# EAGLE design rocketpanda_v1 (EAGLE 9.0.1)
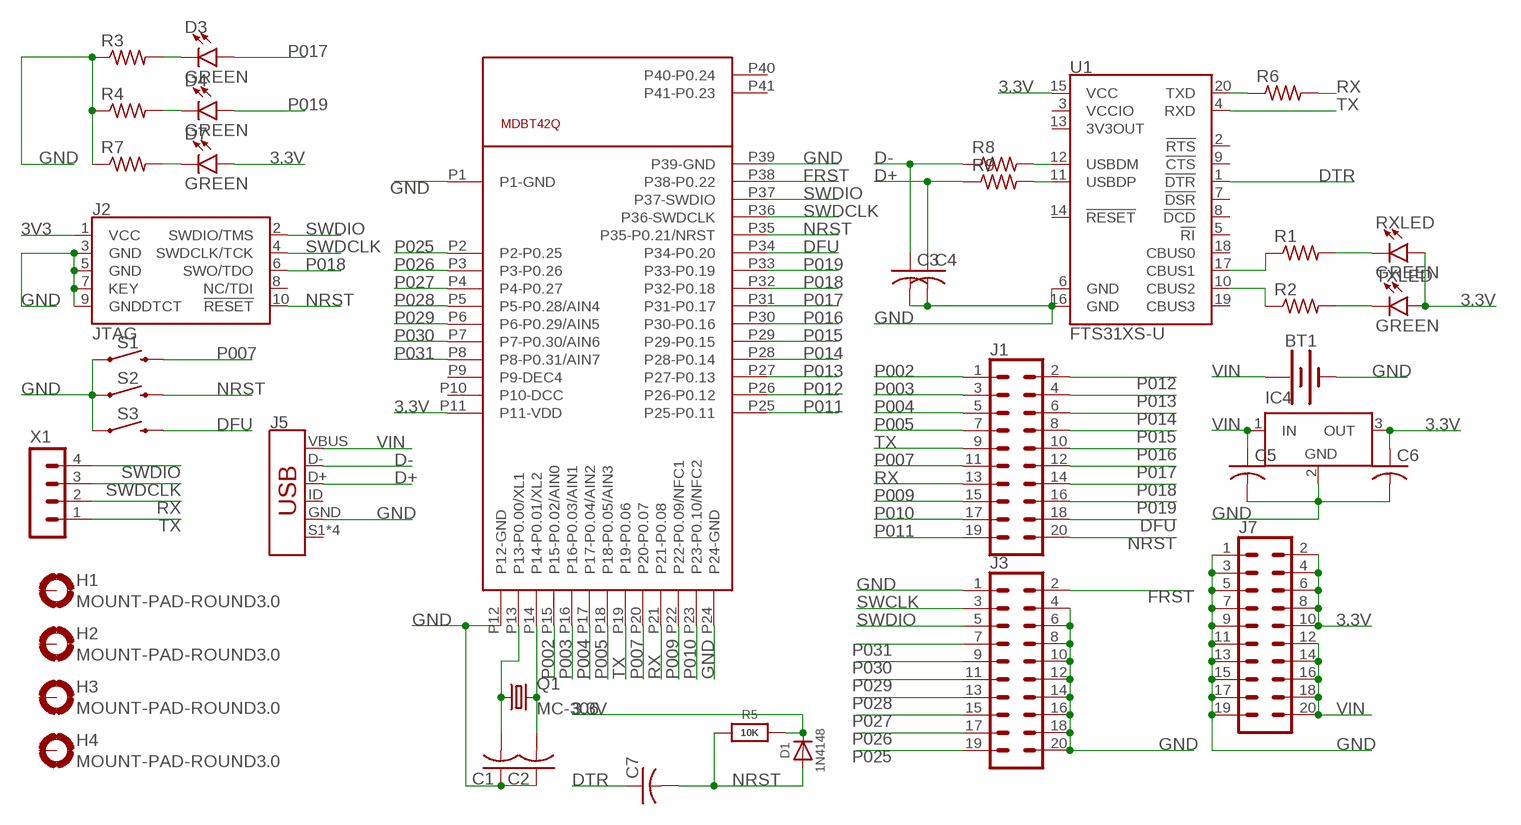
[diagram p0: schematic, sheet 1]

## Parts
BT1  BATTERY-20MM_SMD_4LEGS_OVERPASTE_INNER  [BATTCON_20MM_4LEGS_OVERPASTE_INNER]
C1  C-USC0805  [C0805]
C2  C-USC0805  [C0805]
C3  C-USC0805  [C0805]
C4  C-USC0805  [C0805]
C5  C-USC0805  [C0805]
C6  C-USC0805  [C0805]
C7  C-USC0805  [C0805]
D1  1N4148  DIODESOD-323  [SOD-323]
D3  GREEN  LED-GREENLILYPAD  [LED-1206@1]
D4  GREEN  LED-GREENLILYPAD  [LED-1206@1]
D7  GREEN  LED-GREENLILYPAD  [LED-1206@1]
H1  MOUNT-PAD-ROUND3.0  [3,0-PAD]
H2  MOUNT-PAD-ROUND3.0  [3,0-PAD]
H3  MOUNT-PAD-ROUND3.0  [3,0-PAD]
H4  MOUNT-PAD-ROUND3.0  [3,0-PAD]
IC4  LT1129CST5  [SOT223]
J1  CONN_10X22X10_LOCK  [2X10_LOCK]
J2  JTAG  CORTEX_JTAG_DEBUG_SMD  [2X5-SMD-1.27MM]
J3  CONN_10X22X10_LOCK  [2X10_LOCK]
J5  USB_MINI-B_SMT  [USB-MINIB]
J7  CONN_10X22X10_LOCK  [2X10_LOCK]
Q1  MC-306  [MC-306]
R1  R-US_M0805  [M0805]
R2  R-US_M0805  [M0805]
R3  R-US_M0805  [M0805]
R4  R-US_M0805  [M0805]
R5  10K  RESISTOR0805_NOOUTLINE  [0805-NO]
R6  R-US_M0805  [M0805]
R7  R-US_M0805  [M0805]
R8  R-US_M0805  [M0805]
R9  R-US_M0805  [M0805]
RXLED  GREEN  LED-GREENLILYPAD  [LED-1206@1]
S1  MOMENTARY-SWITCH-SPST-SMD-5.2MM  [TACTILE_SWITCH_SMD_5.2MM]
S2  MOMENTARY-SWITCH-SPST-SMD-5.2MM  [TACTILE_SWITCH_SMD_5.2MM]
S3  MOMENTARY-SWITCH-SPST-SMD-4.6X2.8MM  [TACTILE_SWITCH_SMD_4.6X2.8MM]
TXLED  GREEN  LED-GREENLILYPAD  [LED-1206@1]
U1  FTS31XS-U  FT231XS  [SSOP20_L]
U$1  MDBT42Q  [MDBT40]
X1  B4B-PH-SM4-TB  [B4B-PH-SM4-TB]

## Nets
3.3V: C6.1 D1.C D7.A IC4.3(OUT) J7.2 J7.4 J7.6 J7.8 J7.10 R5.2 RXLED.A TXLED.A U1.15(VCC) U$1.P11(P11-VDD)
3V3: J2.1(VCC)
D+: C4.1 J5.D+ R9.1
D-: C3.1 J5.D- R8.1
DFU: J1.18 S3.3 S3.4 U$1.P34(P34-P0.20)
DTR: C7.1 U1.1(!DTR)
FRST: J3.2 U$1.P38(P38-P0.22)
GND: BT1.2(-) C1.1 C2.1 C3.2 C4.2 C5.2 C6.2 IC4.2(GND) J2.3(GND) J2.5(GND) J2.7(KEY) J2.9(GNDDTCT) J3.1 J3.4 J3.6 J3.8 J3.10 J3.12 J3.14 J3.16 J3.18 J3.20 J5.GND J7.1 J7.3 J7.5 J7.7 J7.9 J7.11 J7.13 J7.15 J7.17 J7.19 R3.1 R4.1 R7.1 S1.1 S2.1 S3.1 S3.2 U1.6(GND) U1.16(GND) U$1.P1(P1-GND) U$1.P12(P12-GND) U$1.P24(P24-GND) U$1.P39(P39-GND)
N$1: D3.C R3.2
N$2: D4.C R4.2
N$3: C2.2 Q1.4 U$1.P14(P14-P0.01/XL2)
N$4: C1.2 Q1.1 U$1.P13(P13-P0.00/XL1)
N$5: D7.C R7.2
N$6: R6.1 U1.20(TXD)
N$40: R1.2 RXLED.C
N$41: R2.2 TXLED.C
N$42: R1.1 U1.17(CBUS1)
N$50: R2.1 U1.10(CBUS2)
N$51: R8.2 U1.12(USBDM)
N$52: R9.2 U1.11(USBDP)
NRST: C7.2 D1.A J1.20 J2.10(!RESET) R5.1 S2.3 U$1.P35(P35-P0.21/NRST)
P002: J1.1 U$1.P15(P15-P0.02/AIN0)
P003: J1.3 U$1.P16(P16-P0.03/AIN1)
P004: J1.5 U$1.P17(P17-P0.04/AIN2)
P005: J1.7 U$1.P18(P18-P0.05/AIN3)
P007: J1.11 S1.3 U$1.P20(P20-P0.07)
P009: J1.15 U$1.P22(P22-P0.09/NFC1)
P010: J1.17 U$1.P23(P23-P0.10/NFC2)
P011: J1.19 U$1.P25(P25-P0.11)
P012: J1.2 U$1.P26(P26-P0.12)
P013: J1.4 U$1.P27(P27-P0.13)
P014: J1.6 U$1.P28(P28-P0.14)
P015: J1.8 U$1.P29(P29-P0.15)
P016: J1.10 U$1.P30(P30-P0.16)
P017: D3.A J1.12 U$1.P31(P31-P0.17)
P018: J1.14 J2.6(SWO/TDO) U$1.P32(P32-P0.18)
P019: D4.A J1.16 U$1.P33(P33-P0.19)
P025: J3.19 U$1.P2(P2-P0.25)
P026: J3.17 U$1.P3(P3-P0.26)
P027: J3.15 U$1.P4(P4-P0.27)
P028: J3.13 U$1.P5(P5-P0.28/AIN4)
P029: J3.11 U$1.P6(P6-P0.29/AIN5)
P030: J3.9 U$1.P7(P7-P0.30/AIN6)
P031: J3.7 U$1.P8(P8-P0.31/AIN7)
RX: J1.13 R6.2 U$1.P21(P21-P0.08) X1.2
SWCLK: J3.3
SWDCLK: J2.4(SWDCLK/TCK) U$1.P36(P36-SWDCLK) X1.3
SWDIO: J2.2(SWDIO/TMS) J3.5 U$1.P37(P37-SWDIO) X1.4
TX: J1.9 U1.4(RXD) U$1.P19(P19-P0.06) X1.1
VIN: BT1.1(+) C5.1 IC4.1(IN) J5.VBUS J7.12 J7.14 J7.16 J7.18 J7.20
Unconnected: H1.B3,0(MOUNT) H2.B3,0(MOUNT) H3.B3,0(MOUNT) H4.B3,0(MOUNT) J2.8(NC/TDI) J5.ID J5.S1(SHIELD) J5.S2(SHIELD) J5.S3(SHIELD) J5.S4(SHIELD) U1.2(!RTS) U1.3(VCCIO) U1.5(!RI) U1.7(!DSR) U1.8(!DCD) U1.9(!CTS) U1.13(3V3OUT) U1.14(!RESET) U1.18(CBUS0) U1.19(CBUS3) U$1.P9(P9-DEC4) U$1.P10(P10-DCC) U$1.P40(P40-P0.24) U$1.P41(P41-P0.23)

## Power pins joined to a net without a drawn wire
GND: IC4.4(GND)

## Library data of the parts
BT1 = SparkFun-Batteries:BATTERY: Battery - Single Cell A variety of battery chemistries, sizes, and footprints. Device List: 20MM_PTH - Coin Cell Battery Holder - 20mm (PTH) <https://www.sparkfun.com/products/783> 20MM_PTH_KIT- Coin Cell battery Holder - 20 mm (PTH) <http://www.sparkfun.com/products/783>kit version with special mask 6.8MM_PTH - Coin Cell Battery Holder - 6.8MM(SMD) <https://www.digikey.com/product-detail/en/seiko-instruments/MS621FE-FL11E/728-1057-ND/1889208?WT.srch=1&gclid=CNOQ5a6LzdQCFZS2wAodXCkE0g> 12MM_SMD - Coin Cell Battery Holder - 12mm (SMD) <https://www.sparkfun.com/products/10592> 12MM_PTH - Coin Cell Battery Holder - 12mm (PTH) <https://www.sparkfun.com/products/7948> 20MM_SMD - 20mm Coin Cell Battery Holder (SMD) (2 legs) Used on the Big Time Watch Kit <https://www.sparkfun.com/products/11734> 20MM_SMD_4LEGS - Coin Cell Battery Holder - 20mm (SMD) <https://www.sparkfun.com/products/11892> 20MM_SMD_4LEGS_OVERPASTE - Coin Cell Battery Holder - 20mm (SMD) <https://www.sparkfun.com/products/11892> (Over-paste on the legs) 24.5MM_PTH - Coin Cell Battery Holder - 24.5mm (PTH) <https://www.sparkfun.com/products/8863> 9V - 9V Battery Holder - PC Mount Used on the SparkFun SparkPunk Sound Kit <https://www.sparkfun.com/products/11177> and SparkFun SparkPunk Sequencer Kit <https://www.sparkfun.com/products/12707> 18650 - Battery Holder - 18650 (PTH) <https://www.sparkfun.com/products/13113> AA - Battery Holder - 1xAA (PTH) <https://www.sparkfun.com/products/7949> AAA - Battery Holder - 1xAAA (PTH) <https://www.sparkfun.com/products/12718> AA_KIT - Battery Holder - 1xAA (PTH) <https://www.sparkfun.com/products/7949> Special kit package - pads only have exposed copper on one side of the board. AAA_KIT - Battery Holder - 1xAAA (PTH) <https://www.sparkfun.com/products/12718> Special kit package - pads only have exposed copper on one side of the board.
C1-C7 = adafruit:C-US: CAPACITOR, American symbol
D1 = microbuilder:DIODE: Diode SMA Model Volts Amps Type Vf Ir Digikey # Notes SSA34-E3 40V 3A Schottky 480mV @ 3A 200uA @ 40V SSA34-E3/61TGITR-ND CDBA120-G 20V 1A Schottky 500mV @ 1A 500uA @ 20V 641-1014-6-ND REEL MBRA210 10V 2A Schottky 350mV @ 2A 700uA @ 10V MBRA210LT3 SOD-123 Model Volts Amps Type Vf Ir Order # Notes BAT54T1G 30V 200mA Schottky 800mV @ 200mA 2uA @ 25V BAT54T1GOSTR-ND B0530W 30V 500mA Schottky 430mV @ 500mA 130uA @ 30V B0530W-FDICT-ND REEL MBR120 20V 1A Schottky 340mV @ 1A MBR120VLSFT1GOSCT-ND SOD-323 Model Volts Amps Type Vf Ir Order # Notes PMEG2005EJ 20V 500mA Schottky 355mV @ 500mA 568-4110-1-ND ZLLS410 10V 570mA Schottky 380mV @ 570mA ZLLS410CT-ND 1N4148WS 75V 150mA Silicon/Simple 1V 1N4148WSFSCT-ND REEL SOD-523 Model Volts Amps Type Vf Ir Order # Notes BAT54XV2 30V 200mA Schottky 0.8V @ 100mA BAT54XV2CT-ND TB751S 30V 30mA Schottky RB751S-40TE61CT-ND SOT23-R/W (R = Solder Paste/Reflow Ovens, W = Hand-Soldering) Model Volts Amps Type Vf Ir Order # Notes BAT54FILM 40V 300mA Schottky 497-7162-1-ND POWERDI-5 Model Volts Amps Type Vf Ir Order # Notes PDS560 60V 5A Schottky 670mV @ 5A 150uA @ 60V PDS560DICT-ND
D3 D4 D7 RXLED TXLED = SparkFun-LED:LED-GREEN: Green SMD LED Used in manufacturing of various products at SparkFun Packages: 0603 - SMD 0603 package [Product Link] <http://www.futureelectronics.com/en/technologies/semiconductors/optoelectronics/leds/Pages/9894312-LTST-C190GKT.aspx?CrossPart=HSMG-C190&IM=0> LilyPad 1206 - SMD1206 LilyPad package [Product Link] <http://www.futureelectronics.com/en/Technologies/Product.aspx?ProductID=IN150NGHARVATEKCORPORATION2049943&IM=0> 1206 - SMD1206 package [Product Link] <http://www.futureelectronics.com/en/technologies/semiconductors/optoelectronics/leds/Pages/8315665-LTST-C150KGKT.aspx?IM=0> 1206 Bottom Mount -SMD 1206 Bottom Mount [Product Link] <http://www.digikey.com/product-detail/en/lite-on-inc/LTST-C230KGKT/160-1456-1-ND/386854> SparkFun Products: Pro Mini 328 -5V <https://www.sparkfun.com/products/821> RedBoard <https://www.sparkfun.com/products/12757> MP3 Trigger <https://www.sparkfun.com/products/13720> Makey Makey <https://www.sparkfun.com/products/11076>; PROD_ID: DIO-09910
H1-H4 = holes:MOUNT-PAD-ROUND: MOUNTING PAD, round
IC4 = linear-technology:LT1129CST5: VOLTAGE REGULATOR with shutdown; MPN: LT1129CST-5#PBF; OC_FARNELL: 1663375; OC_NEWARK: 57M2069
J1 J3 J7 = SparkFun-Connectors:CONN_10X2: Multi connection point. Often used as Generic Header-pin footprint for 0.1 inch spaced/style header connections On any of the 0.1 inch spaced packages, you can populate with these: Break Away Headers - Straight <https://www.sparkfun.com/products/116> (PRT-00116) Break Away Male Headers - Right Angle <https://www.sparkfun.com/products/553> (PRT-00553) Female Headers <https://www.sparkfun.com/products/115> (PRT-00115) Break Away Headers - Machine Pin <https://www.sparkfun.com/products/117> (PRT-00117) Break Away Female Headers - Swiss Machine Pin <https://www.sparkfun.com/products/743> (PRT-00743) Special note about the "SPECIAL" package: This was SPECIALLY designed to be used with our Graphic LCD Backpack. Be sure you want to use this! It is not only staggered on each line of header holes, but IT IS ALSO offset of the center point of the top and bottom lines by 5 mil. This causes the headers to lock into place on the "standard" footprint on the LCD screen. The extra squares on the tdocu layer are there simply to reference other pins (if you were to actually populate a longer header than ten long - this is what we do with the backpacks).
J2 = SparkFun-Connectors:CORTEX_JTAG_DEBUG: Cortex Debug Connector - 10 pin Supports JTAG debug, Serial Wire debug, and Serial Wire Viewer. PTH and SMD connector options available. General Connector Information <http://infocenter.arm.com/help/topic/com.arm.doc.faqs/attached/13634/cortex_debug_connectors.pdf> Products: PTH Connector <http://www.digikey.com/product-detail/en/cnc-tech/3220-10-0100-00/1175-1627-ND/3883661> -via Digi-Key SparkFun PSoc <https://www.sparkfun.com/products/13229> SparkFun T <https://www.sparkfun.com/products/13810>; PROD_ID: CONN-14503
J5 = SparkFun-Connectors:USB_MINI-B: USB type Mini-B Connector Breaks out 5th pin, and includes shield pins if needed. SparkFun Products: SparkFun FTDI Basic Breakout <https://www.sparkfun.com/products/9716> SparkFun XBee Explorer USB <https://www.sparkfun.com/products/11812> SparkFun Redboard <https://www.sparkfun.com/products/12757>; PROD_ID: CONN-08193; SF_ID: PRT-00587
Q1 = crystal:MC-306: kHz RANGE CRYSTAL UNIT SMD Source: MC-306_405_406_E07X.PDF Homepage <http://www.epsontoyocom.co.jp>; MPN: MC-306 60.0KHZ 100PPM ,12.5PF; OC_FARNELL: 1278040; OC_NEWARK: 31M5576
R1-R4 R6-R9 = adafruit:R-US_: RESISTOR, American symbol
R5 = microbuilder:RESISTOR: Resistors For new designs, use the packages preceded by an '_' character since they are more reliable: The following footprints should be used on most boards: _0402 - Standard footprint for regular board layouts _0603 - Standard footprint for regular board layouts _0805 - Standard footprint for regular board layouts _1206 - Standard footprint for regular board layouts For extremely tight-pitch boards where space is at a premium, the following 'micro-pitch' footprints can be used (smaller pads, no silkscreen outline, etc.): _0402MP - Micro-pitch footprint for very dense/compact boards _0603MP - Micro-pitch footprint for very dense/compact boards _0805MP - Micro-pitch footprint for very dense/compact boards _1206MP - Micro-pitch footprint for very dense/compact boards
S1 S2 = SparkFun-Switches:MOMENTARY-SWITCH-SPST: Momentary Switch (Pushbutton) - SPST Normally-open (NO) SPST momentary switches (buttons, pushbuttons). Variants PTH-12MM - 12mm square, through-hole Momentary Pushbutton Switch - 12mm Square <https://www.sparkfun.com/products/9190> (COM-09190) PTH-6.0MM, PTH-6.0MM-KIT - 6.0mm square, through-hole Mini Pushbutton Switch <https://www.sparkfun.com/products/97> (COM-00097) KIT package intended for soldering kit's - only one side of pads' copper is exposed. PTH-RIGHT-ANGLE-KIT - Right-angle, through-hole Right Angle Tactile Button <https://www.sparkfun.com/products/10791> - Used on SparkFun BigTime Watch Kit <https://www.sparkfun.com/products/11734> SMD-12MM - 12mm square, surface-mount Tactile Button - SMD (12mm) <https://www.sparkfun.com/products/12993> (COM-12993) Used on SparkFun PicoBoard <https://www.sparkfun.com/products/11888> SMD-4.5MM - 4.5mm Square Trackball Switch Used on SparkFun Blackberry Trackballer Breakout <https://www.sparkfun.com/products/13169> SMD-4.6MMX2.8MM - 4.60mm x 2.80mm, surface mount Used on SparkFun SAMD21 Mini Breakout <https://www.sparkfun.com/products/13664> SMD-5.2MM, SMD-5.2-REDUNDANT - 5.2mm square, surface-mount Mini Pushbutton Switch - SMD <https://www.sparkfun.com/products/8720> (COM-08720) Used on Arduino Pro Mini <https://www.sparkfun.com/products/11114> REDUNDANT package connects both switch circuits together SMD-6.0X3.5MM - 6.0 x 3.5mm, surface mount Momentary Reset Switch SMD <https://www.sparkfun.com/products/8229> (COM-08229) SMD-6.2MM-TALL - 6.2mm square, surface mount Tactile Button - SMD (6mm) <https://www.sparkfun.com/products/12992> Used on SparkFun Digital Sandbox <https://www.sparkfun.com/products/12651> SMD-RIGHT-ANGLE - Right-angle, surface mount Used on SparkFun Block for Intel® Edison - Arduino <https://www.sparkfun.com/products/13036>; PROD_ID: SWCH-08247; SF_SKU: COM-08720
S3 = SparkFun-Switches:MOMENTARY-SWITCH-SPST: Momentary Switch (Pushbutton) - SPST Normally-open (NO) SPST momentary switches (buttons, pushbuttons). Variants PTH-12MM - 12mm square, through-hole Momentary Pushbutton Switch - 12mm Square <https://www.sparkfun.com/products/9190> (COM-09190) PTH-6.0MM, PTH-6.0MM-KIT - 6.0mm square, through-hole Mini Pushbutton Switch <https://www.sparkfun.com/products/97> (COM-00097) KIT package intended for soldering kit's - only one side of pads' copper is exposed. PTH-RIGHT-ANGLE-KIT - Right-angle, through-hole Right Angle Tactile Button <https://www.sparkfun.com/products/10791> - Used on SparkFun BigTime Watch Kit <https://www.sparkfun.com/products/11734> SMD-12MM - 12mm square, surface-mount Tactile Button - SMD (12mm) <https://www.sparkfun.com/products/12993> (COM-12993) Used on SparkFun PicoBoard <https://www.sparkfun.com/products/11888> SMD-4.5MM - 4.5mm Square Trackball Switch Used on SparkFun Blackberry Trackballer Breakout <https://www.sparkfun.com/products/13169> SMD-4.6MMX2.8MM - 4.60mm x 2.80mm, surface mount Used on SparkFun SAMD21 Mini Breakout <https://www.sparkfun.com/products/13664> SMD-5.2MM, SMD-5.2-REDUNDANT - 5.2mm square, surface-mount Mini Pushbutton Switch - SMD <https://www.sparkfun.com/products/8720> (COM-08720) Used on Arduino Pro Mini <https://www.sparkfun.com/products/11114> REDUNDANT package connects both switch circuits together SMD-6.0X3.5MM - 6.0 x 3.5mm, surface mount Momentary Reset Switch SMD <https://www.sparkfun.com/products/8229> (COM-08229) SMD-6.2MM-TALL - 6.2mm square, surface mount Tactile Button - SMD (6mm) <https://www.sparkfun.com/products/12992> Used on SparkFun Digital Sandbox <https://www.sparkfun.com/products/12651> SMD-RIGHT-ANGLE - Right-angle, surface mount Used on SparkFun Block for Intel® Edison - Arduino <https://www.sparkfun.com/products/13036>; PROD_ID: SWCH-13065
U1 = SparkFun-DigitalIC:FT231X: FTDI FT231X Full Speed USB to Full-handshake UART This USB2.0 Full Speed IC offers a compact bridge to full handshake UART interfaces. The device is a UART, capable of operating up to 3MBaud, with low power consumption (8mA). The FT231X includes the complete FT-X series feature set and enables USB to be added into a system design quickly and easily over a UART interface.; PROD_ID: IC-11524
U$1 = mdbt42:MDBT42Q
X1 = con-JST PH:B4B-PH: JST PH series header 2.00mm pitch disconnectable crimp style connectors, vertical (side entry type), 4 pins

## Board
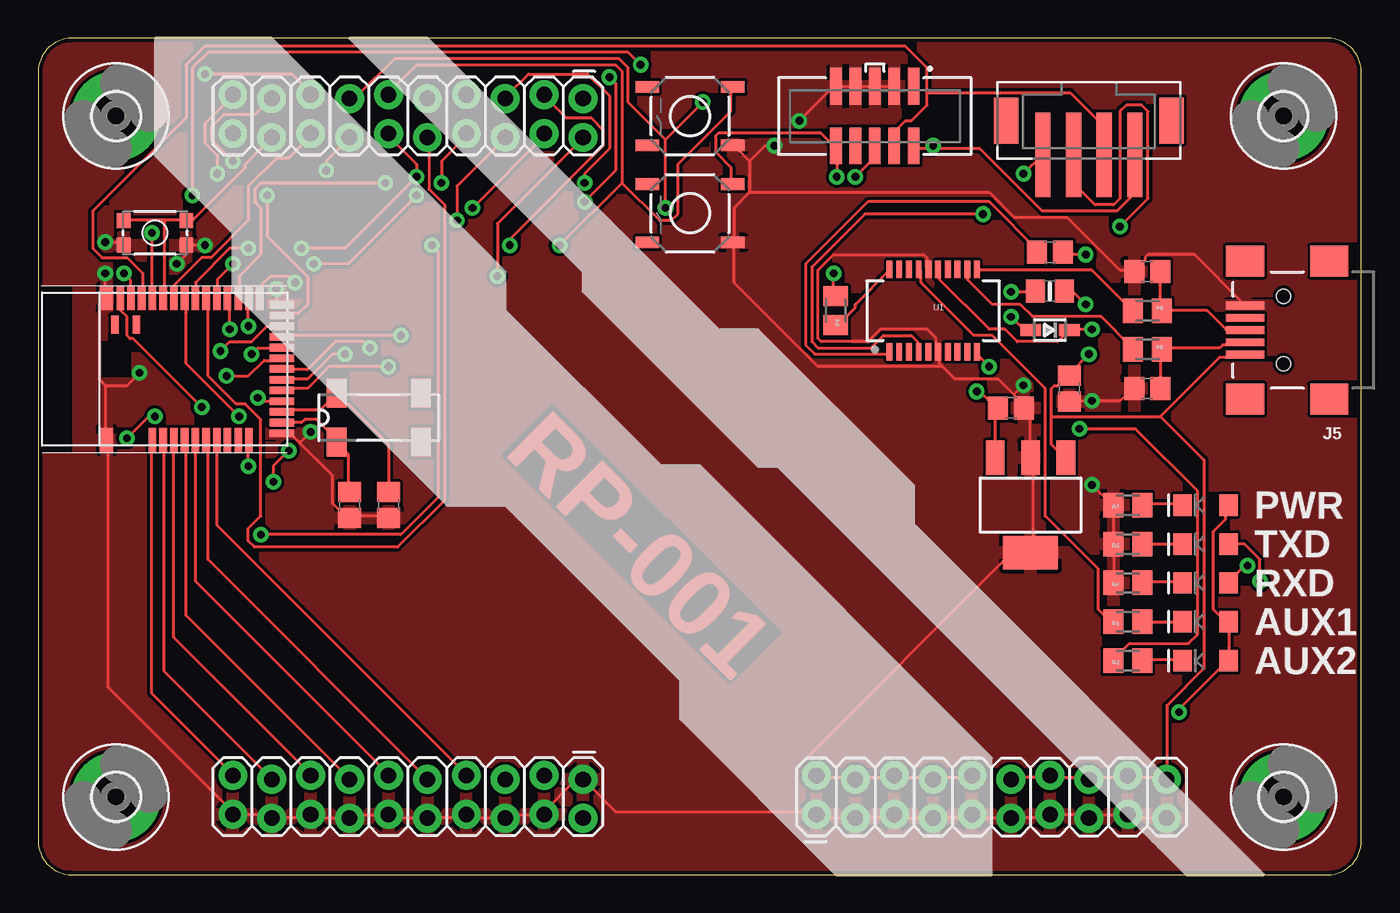
[diagram p1: board, top side]
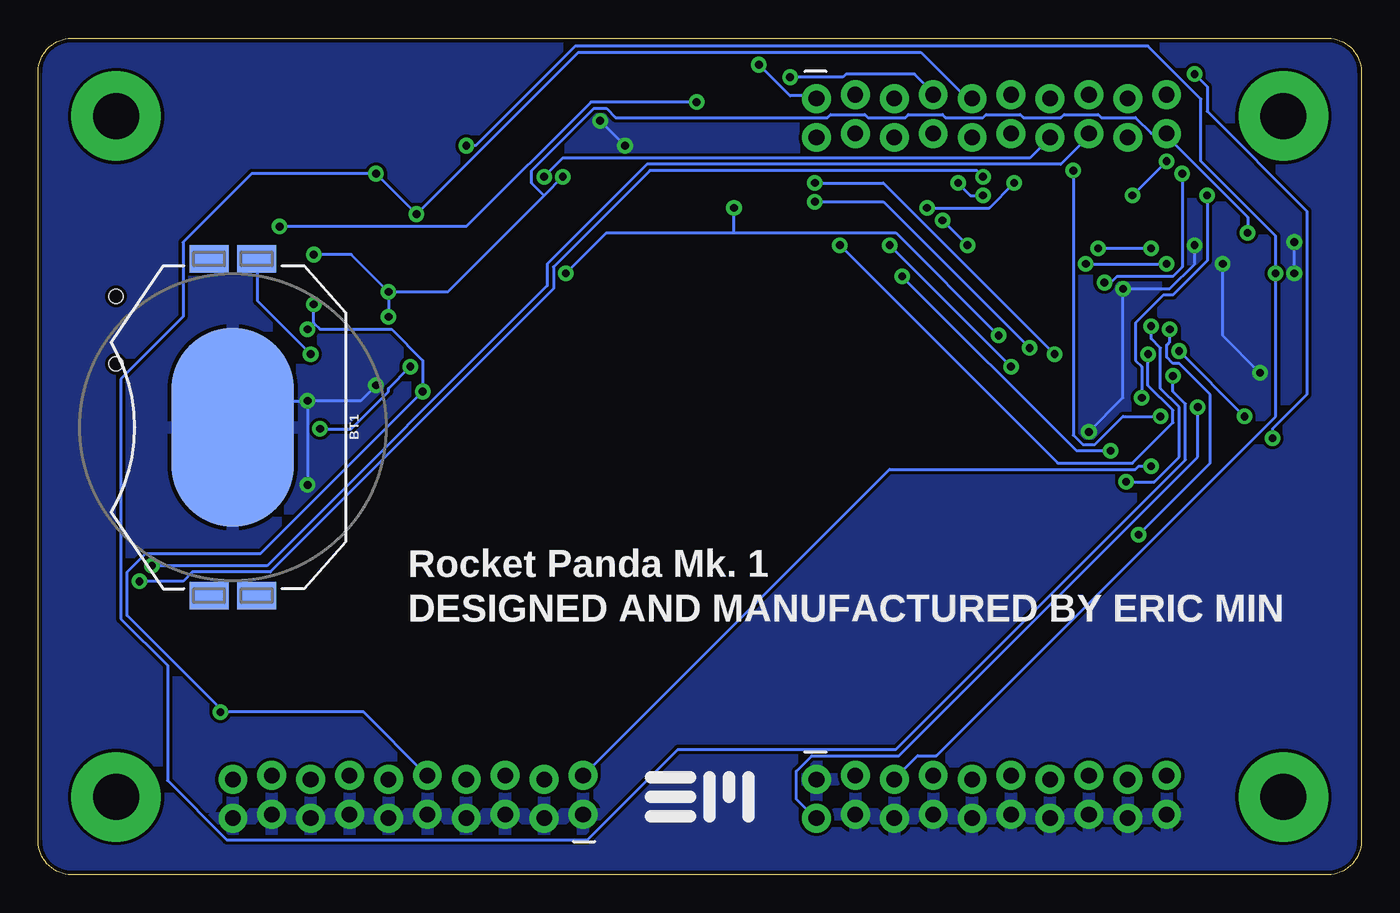
[diagram p2: board, bottom side, seen from below]

Size 86.36 x 54.61 mm. Coordinates in mm from the lower left corner, seen from the top.
Outline: 0,2.17 arc90 2.17,0 84.19,0 arc90 86.36,2.17 86.36,52.44 arc90 84.19,54.61 2.17,54.61 arc90 0,52.44 0,2.17
Copper layers (1*16): Top 0.035mm / dielectric 1.5mm / Bottom 0.035mm
Design rules "SparkFun": minimum track width 8mil, minimum drill 20mil, track to track 8mil, track to pad 8mil, pad to pad 8mil, via to via 8mil, smd to smd 8mil, copper to edge 10mil, drill to drill 8mil, minimum pad ring 12mil, minimum via ring 10mil, stop-mask expansion 4mil, vias tented up to drill 25mil, thermal gap 10mil
tKeepout: area 0,8.9 to 3.2,45.7
bKeepout: area 0,8.9 to 3.2,45.7

### Footprints (pad centres in the part's own frame; a part is rotated, then mirrored left to right if it is on the bottom)
BATTCON_20MM_4LEGS_OVERPASTE_INNER = smd 1.778 x 2.54: 1 -11,1.55; 3 11,1.55; P$1 -11,-1.55; P$2 11,-1.55 | smd 13 x 8: 2 0,0
C0805 = smd 1.3 x 1.5: 1 -0.85,0; 2 0.85,0
SOD-323 = smd 1.35 x 0.8: A 1.27,0; C -1.27,0
LED-1206@1 = smd 1.2 x 1.4: A -1.5,0; C 1.5,0
3,0-PAD = drill 3 pad 5.842: B3,0 0,0
SOT223 = smd 1.219 x 2.235: 1 -2.311,-3.099; 2 0,-3.099; 3 2.311,-3.099 | smd 3.6 x 2.2: 4 0,3.099
2X10_LOCK = drill 1.016 pad 1.88: 1 0,0.127; 2 0,2.667; 3 2.54,-0.127; 4 2.54,2.413; 5 5.08,0.127; 6 5.08,2.667; 7 7.62,-0.127; 8 7.62,2.413; 9 10.16,0.127; 10 10.16,2.667; 11 12.7,-0.127; 12 12.7,2.413; 13 15.24,0.127; 14 15.24,2.667; 15 17.78,-0.127; 16 17.78,2.413; 17 20.32,0.127; 18 20.32,2.667; 19 22.86,-0.127; 20 22.86,2.413
2X5-SMD-1.27MM = smd 0.76 x 2.4: 1 2.54,1.95; 2 2.54,-1.95; 3 1.27,1.95; 4 1.27,-1.95; 5 0,1.95; 6 0,-1.95; 7 -1.27,1.95; 8 -1.27,-1.95; 9 -2.54,1.95; 10 -2.54,-1.95
USB-MINIB = smd 2.5 x 0.5: D+ 2.5,0; D- 2.5,0.8; GND 2.5,-1.6; ID 2.5,-0.8; VBUS 2.5,1.6 | smd 2.5 x 2: S1 -3,4.5; S2 2.5,4.5; S3 -3,-4.5; S4 2.5,-4.5 | hole 0.9: 0,2.2; 0,-2.2
MC-306 = smd 1.3 x 1.9: 1 -2.75,-1.6; 2 2.75,-1.6; 3 2.75,1.6; 4 -2.75,1.6
M0805 = smd 1.3 x 1.6: 1 -0.95,0; 2 0.95,0
0805-NO = smd 1.24 x 1.5: 1 -0.95,0; 2 0.95,0
TACTILE_SWITCH_SMD_5.2MM = smd 1.524 x 0.762: 1 -2.794,1.905; 2 2.794,1.905; 3 -2.794,-1.905; 4 2.794,-1.905
TACTILE_SWITCH_SMD_4.6X2.8MM = smd 0.9 x 1: 1 -2.05,-0.8; 2 2.05,-0.8; 3 2.05,0.8; 4 -2.05,0.8
SSOP20_L = smd 0.381 x 1.143: 1 -2.857,-2.68; 2 -2.223,-2.68; 3 -1.587,-2.68; 4 -0.953,-2.68; 5 -0.318,-2.68; 6 0.318,-2.68; 7 0.953,-2.68; 8 1.587,-2.68; 9 2.223,-2.68; 10 2.857,-2.68; 11 2.857,2.68; 12 2.223,2.68; 13 1.587,2.68; 14 0.953,2.68; 15 0.318,2.68; 16 -0.318,2.68; 17 -0.953,2.68; 18 -1.587,2.68; 19 -2.223,2.68; 20 -2.857,2.68
MDBT40 = smd 1.6 x 0.9: P1 -4.65,3.8; P39 4.65,3.8 | smd 1.6 x 0.5: P2 -4.65,0.8; P3 -4.65,0.1; P4 -4.65,-0.6; P5 -4.65,-1.3; P6 -4.65,-2; P7 -4.65,-2.7; P8 -4.65,-3.4; P9 -4.65,-4.1; P10 -4.65,-4.8; P11 -4.65,-5.5; P25 4.65,-6.2; P26 4.65,-5.5; P27 4.65,-4.8; P28 4.65,-4.1; P29 4.65,-3.4; P30 4.65,-2.7; P31 4.65,-2; P32 4.65,-1.3; P33 4.65,-0.6; P34 4.65,0.1; P35 4.65,0.8; P36 4.65,1.5; P37 4.65,2.2; P38 4.65,2.9 | smd 0.5 x 1.6: P12 -4.2,-7.65; P13 -3.5,-7.65; P14 -2.8,-7.65; P15 -2.1,-7.65; P16 -1.4,-7.65; P17 -0.7,-7.65; P18 0,-7.65; P19 0.7,-7.65; P20 1.4,-7.65; P21 2.1,-7.65; P22 2.8,-7.65; P23 3.5,-7.65; P24 4.2,-7.65 | smd 1.2 x 0.5: P40 2.9,3.25; P41 2.9,1.85
B4B-PH-SM4-TB = smd 1 x 5.5: 1 3,0; 2 1,0; 3 -1,0; 4 -3,0 | smd 1.6 x 3: M1 5.4,-2.25; M2 -5.4,-2.25

### Placement (x,y rotation side)
BT1  73.66,29.21 270 bottom
C1  20.32,24.13 90 top
C2  22.86,24.13 90 top
C3  72.39,31.75 180 top
C4  72.39,39.37 180 top
C5  67.31,31.75 270 top
C6  63.5,30.48 0 top
C7  66.04,40.64 0 top
D1  66.04,35.56 180 top
D3  76.2,21.59 180 top
D4  76.2,19.05 180 top
D7  76.2,24.13 180 top
H1  5.08,49.53 0 top
H2  81.28,49.53 0 top
H3  5.08,5.08 0 top
H4  81.28,5.08 0 top
IC4  64.77,24.13 180 top
J1  35.56,50.8 180 top
J2  54.61,49.53 0 top
J3  35.56,6.35 180 top
J5  81.28,35.56 180 top
J7  50.8,3.81 0 top
Q1  22.22,29.84 0 top
R1  71.12,16.51 0 top
R2  71.12,13.97 0 top
R3  71.12,21.59 0 top
R4  71.12,19.05 0 top
R5  66.04,38.1 0 top
R6  52.07,36.83 90 top
R7  71.12,24.13 0 top
R8  72.39,34.29 180 top
R9  72.39,36.83 180 top
RXLED  76.2,16.51 180 top
S1  42.55,49.53 180 top
S2  42.55,43.18 180 top
S3  7.62,41.91 0 top
TXLED  76.2,13.97 180 top
U1  58.42,36.83 0 top
U$1  8.25,33.02 90 top
X1  68.58,46.99 180 top

### Tracks (layer width: path | path; a pad name or v marks a point on that pad's centre or on a via)
3.3V  (via drill 0.51)
  Top 0.203: IC4.3 62.48,27.28 62.48,30.33 C6.1 62.48,30.53 61.47,31.55 v61.27,31.55 | U1.15 58.83,39.47 58.83,38.86 62.08,35.61 63.09,35.61 63.91,34.8 66.55,34.8 D1.C 67.36,35.61 v68.78,35.61 | v68.38,37.24 67.56,38.05 67.16,38.05 R5.2 | D7.A 77.52,24.03 77.52,23.22 76.71,22.4 76.71,17.32 77.52,16.51 RXLED.A 77.72,16.51 77.72,14.07 TXLED.A 77.52,13.87 74.47,10.82 v74.47,10.62 | 58.42,6.35 55.98,6.35 J7.6 55.78,6.35 53.34,6.35 | 58.42,6.35 60.86,6.35 J7.10 | 58.42,6.35 J7.8 | v13.72,26.67 13.72,28.3 U$1.P11 | 53.34,6.35 50.9,6.35 J7.2 | 53.34,6.35 J7.4
  Bottom 0.203: 68.38,36.02 v68.38,37.24 | v68.78,35.61 68.38,36.02 | 68.38,36.02 67.97,35.61 63.3,35.61 61.27,33.58 v61.27,31.55 71.83,20.98 79.35,20.98 80.57,19.76 80.57,16.92 74.27,10.62 | 74.27,10.62 65.13,10.62 61.06,6.55 J7.10 | 74.27,10.62 v74.47,10.62 | v13.72,26.67 14.53,26.67 14.73,26.47 30.79,26.47 50.7,6.55 J7.2
D+
  Top 0.203: C4.1 73.25,39.27 73.25,36.83 R9.1 76.3,36.83 77.52,35.61 78.74,35.61 J5.D+
D-
  Top 0.203: C3.1 73.25,31.75 73.25,34.19 R8.1 73.46,34.39 77.11,34.39 77.32,34.6 78.74,34.6 J5.D-
DFU
  Top 0.203: 8.23,42.72 9.65,42.72 S3.3 9.86,42.52 13.51,46.18 13.51,46.38 15.14,48.01 J1.18 | 8.23,42.72 5.59,42.72 S3.4 | 8.23,42.72 8.23,37.85 U$1.P34
DTR
  Top 0.203: U1.1 55.57,33.99 50.7,33.99 50.09,34.6 50.09,39.88 54.15,43.94 62.08,43.94 65.33,40.69 C7.1
FRST  (via drill 0.51)
  Top 0.203: v10.67,30.53 6.2,35 5.99,35 5.79,35.2 5.79,36.42 5.38,36.83 5.38,37.64 U$1.P38
  Bottom 0.203: v10.67,30.53 10.67,27.28 30.18,7.77 35.87,7.77 36.88,6.76 36.88,4.93 35.66,3.71 J3.2
GND  (via drill 0.51)
  Top 0.203: 70.21,21.59 70.21,19.15 R4.1 | 70.21,21.59 70.21,24.03 R7.1 70,24.23 v68.78,25.45 | 70.21,21.59 R3.1 | C5.2 67.36,30.94 v68.78,30.94 70.61,30.94 71.43,31.75 C3.2 | J5.GND 78.74,37.24 75.49,40.49 72.44,40.49 72.24,40.28 72.24,40.08 71.63,39.47 C4.2 71.43,39.47 70.61,39.47 67.16,42.93 63.7,42.93 62.08,44.55 46.43,44.55 | 53.34,51.46 52.12,51.46 J2.9 51.92,51.46 v49.68,49.23 | J2.3 55.78,51.46 54.76,51.46 J2.5 54.56,51.46 53.34,51.46 | 53.34,51.46 J2.7 | 46.43,44.55 45.41,43.54 45.41,41.3 S2.1 45.41,41.1 45.41,38.66 50.9,33.17 59.03,33.17 | 46.43,46.58 46.43,44.55 | 46.43,46.58 45.41,47.6 S1.1 | 59.03,33.17 59.84,32.36 62.69,32.36 63.7,31.34 | 59.03,33.17 58.83,33.38 58.83,33.99 U1.6 58.62,34.19 58.62,35 58.01,35.61 54.97,35.61 54.15,34.8 51.1,34.8 50.9,35 50.9,39.47 51.92,40.49 57.81,40.49 58.01,40.28 58.01,39.68 U1.16 | 63.7,31.34 64.52,30.53 C6.2 64.52,30.33 64.72,30.12 64.72,27.28 IC4.2 64.92,27.08 64.92,21.18 IC4.4 64.72,20.98 63.5,20.98 49.48,6.96 49.48,4.12 | v48.06,47.6 47.45,47.6 46.43,46.58 | 63.7,31.34 v64.31,31.95 | v10.87,41.1 9.86,41.1 S3.2 9.65,41.1 9.65,40.49 v9.04,39.88 | v15.55,38.25 15.55,37.44 15.75,37.24 U$1.P24 | C2.1 22.86,23.42 20.42,23.42 C1.1 20.22,23.22 19.2,24.23 19.2,26.06 16.97,28.3 | 16.97,28.3 16.56,28.7 15.95,28.7 U$1.P12 | v17.78,28.91 17.17,28.3 16.97,28.3 | 53.34,3.71 51.1,3.71 50.9,3.91 J7.1 50.7,4.12 49.48,4.12 | 58.42,3.71 56.19,3.71 55.98,3.91 J7.5 55.78,3.91 55.57,3.71 53.34,3.71 | 53.34,3.71 J7.3 | 63.5,3.71 61.27,3.71 61.06,3.91 J7.9 60.86,3.91 60.66,3.71 58.42,3.71 | 68.38,3.91 66.14,3.91 J7.13 65.94,3.91 65.73,3.71 63.5,3.71
  Top 0.203: 68.38,3.91 68.58,3.71 J7.15 68.38,3.91 | 68.38,3.91 71.02,3.91 J7.17 71.22,3.91 71.43,3.71 73.66,3.71 J7.19 | 63.5,3.71 J7.11 | 58.42,3.71 J7.7 | 27.74,3.71 25.5,3.71 J3.10 25.3,3.71 23.06,3.71 22.86,3.91 | 27.74,3.71 27.94,3.91 J3.8 27.74,3.71 | 27.74,3.71 30.38,3.71 J3.6 30.58,3.71 30.79,3.91 33.02,3.91 J3.4 33.02,4.12 35.05,6.15 35.46,6.15 J3.1 35.66,6.15 37.69,4.12 49.48,4.12 | v4.37,41.3 5.38,41.3 S3.1 | v4.37,39.27 4.37,37.85 U$1.P39 4.37,37.64 3.96,37.24 3.96,32.36 4.37,31.95 | 4.37,31.95 4.37,28.5 U$1.P1 4.57,28.3 4.57,12.24 12.7,4.12 J3.20 12.7,3.91 14.93,3.91 15.14,3.71 J3.18 15.34,3.71 17.58,3.71 | 17.58,3.71 17.78,3.91 J3.16 17.58,3.71 | 17.58,3.71 20.22,3.71 J3.14 20.42,3.71 20.62,3.91 22.86,3.91 | 22.86,3.91 J3.12 | v6.6,32.77 5.79,31.95 4.37,31.95
  Bottom 0.203: v68.78,30.94 72.03,30.94 73.66,29.31 BT1.2 | v68.78,30.94 v68.78,25.45 | v48.06,47.6 v49.68,49.23 | v68.78,30.94 65.33,30.94 v64.31,31.95 | v10.87,41.1 10.87,39.88 12.5,38.25 v15.55,38.25 15.55,31.14 v17.78,28.91 | v4.37,39.27 v4.37,41.3 | v9.04,39.88 9.04,35.2 v6.6,32.77
  pour Top: -5.08,62.23 92.71,62.23 92.71,-7.62 -5.08,-7.62
  pour Bottom: -2.54,58.42 88.9,58.42 88.9,-3.81 -2.54,-3.81
N$1
  Top 0.203: R3.2 D3.C
N$2
  Top 0.203: D4.C 74.68,19.15 72.24,19.15 R4.2
N$3
  Top 0.203: C2.2 22.86,28.09 19.61,31.34 Q1.4 19.41,31.34 18.39,30.33 15.95,30.33 U$1.P14
N$4
  Top 0.203: C1.2 20.22,25.04 20.22,27.48 19.61,28.09 Q1.1 19.61,28.3 18.19,29.72 17.37,29.72 17.17,29.52 15.95,29.52 U$1.P13
N$5
  Top 0.203: D7.C 74.68,24.23 72.24,24.23 R7.2
N$6
  Top 0.203: U1.20 55.57,39.47 53.34,37.24 53.34,37.03 52.12,35.81 R6.1
N$40
  Top 0.203: R1.2 RXLED.C
N$41
  Top 0.203: TXLED.C 74.68,14.07 72.24,14.07 R2.2
N$42
  Top 0.203: U1.17 57.61,39.47 57.61,38.66 61.06,35.2 62.28,35.2 65.73,31.75 65.73,23.42 69.19,19.96 69.19,17.32 70,16.51 R1.1
N$50  (via drill 0.51)
  Top 0.203: v62.08,33.17 61.27,33.99 U1.10 | v67.97,29.11 71.63,29.11 75.69,25.04 75.69,15.7 75.08,15.09 71.22,15.09 70.21,14.07 R2.1
  Bottom 0.203: v62.08,33.17 63.5,31.75 63.5,31.55 65.94,29.11 v67.97,29.11
N$51
  Top 0.203: U1.12 60.66,39.47 60.66,38.86 62.28,37.24 64.11,37.24 64.92,36.42 69.39,36.42 71.43,34.39 R8.2
N$52
  Top 0.203: U1.11 61.27,39.47 68.78,39.47 71.43,36.83 R9.2
NRST  (via drill 0.51)
  Top 0.203: v7.42,41.91 7.42,37.85 U$1.P35 | v63.5,36.42 64.31,35.61 64.72,35.61 D1.A | v63.5,38.05 64.92,38.05 R5.1 | v68.38,40.49 66.95,40.49 C7.2 | S2.3 45.21,45.16 45.21,46.18 44.2,47.19 44.2,48.21 44.4,48.41 51.1,48.41 51.92,47.6 J2.10 52.12,47.4 v52.12,45.57
  Bottom 0.203: v7.42,41.91 7.42,42.93 12.7,48.21 J1.20 12.7,48.41 13.72,48.41 14.73,49.43 16.97,49.43 17.17,49.63 19.41,49.63 19.61,49.43 22.05,49.43 22.25,49.63 24.49,49.63 24.69,49.43 27.13,49.43 27.33,49.63 29.57,49.63 29.77,49.43 32.21,49.43 32.41,49.63 34.65,49.63 34.85,49.43 48.67,49.43 49.28,50.04 50.09,50.04 54.15,45.97 54.15,45.16 53.34,44.35 | v63.5,38.05 v63.5,36.42 | v68.38,40.49 65.94,40.49 v63.5,38.05 | v63.5,38.05 59.64,38.05 53.34,44.35 | v52.12,45.57 53.34,44.35
P002  (via drill 0.51)
  Top 0.203: v14.33,31.14 14.53,30.94 15.75,30.94 U$1.P15 | v10.06,44.35 10.06,52.68 11.07,53.7 38.51,53.7 v39.32,52.88
  Bottom 0.203: v14.33,31.14 14.33,33.17 14.73,33.58 14.73,36.02 12.9,37.85 12.29,37.85 10.06,40.08 v10.06,44.35 | v39.32,52.88 37.29,50.85 35.66,50.85 J1.1
P003  (via drill 0.51)
  Top 0.203: v22.86,33.17 19,33.17 17.58,31.75 15.95,31.75 U$1.P16 | v30.79,41.1 30.79,41.5 36.88,47.6 36.88,48.62 36.07,49.43 34.44,49.43 33.02,50.85 J1.3
  Bottom 0.203: v30.79,41.1 v22.86,33.17
P004  (via drill 0.51)
  Top 0.203: v20.02,33.99 19.2,33.99 17.58,32.36 15.95,32.36 U$1.P17 | v35.66,45.16 35.66,45.77 37.29,47.4 37.29,50.85 35.87,52.27 32,52.27 30.58,50.85 J1.5
  Bottom 0.203: v20.02,33.99 31.19,45.16 v35.66,45.16
P005  (via drill 0.51)
  Top 0.203: v21.64,34.39 21.23,34.8 19.41,34.8 17.58,32.97 15.95,32.97 U$1.P18 | v35.66,43.94 37.69,45.97 37.69,51.66 v37.29,52.07
  Bottom 0.203: v21.64,34.39 31.19,43.94 v35.66,43.94 | v37.29,52.07 33.83,52.07 33.63,52.27 29.16,52.27 27.94,51.05 J1.7
P007  (via drill 0.51)
  Top 0.203: 38.1,45.16 40.54,42.72 41.35,42.72 41.76,43.13 41.76,46.38 45.21,49.84 45.21,51.26 S1.3 | 38.1,45.16 38.1,52.48 37.69,52.88 24.69,52.88 22.86,51.05 J1.11 | v13.92,33.99 14.33,34.39 15.75,34.39 U$1.P20 | 38.1,45.16 v34.04,41.1
  Bottom 0.203: v13.92,33.99 13.92,31.95 12.29,30.33 12.29,29.52 14.93,26.87 19.81,26.87 v34.04,41.1
P009  (via drill 0.51)
  Top 0.203: v11.89,34.19 12.5,34.8 13.92,34.8 14.93,35.81 15.75,35.81 U$1.P22 | v7.62,29.92 7.21,29.92 v5.79,28.5 | v10.87,52.27 16.56,52.27 17.78,51.05 J1.15
  Bottom 0.203: v7.62,29.92 v11.89,34.19 | v5.79,28.5 5.79,29.11 3.56,31.34 3.56,43.33 10.06,49.84 10.06,51.46 v10.87,52.27
P010  (via drill 0.51)
  Top 0.203: v14.93,44.35 14.93,41.71 17.58,39.07 17.58,37.24 16.97,36.63 15.95,36.63 U$1.P23 | v12.7,46.58 11.28,48.01 11.28,48.82 12.09,49.63 14.12,49.63 15.14,50.65 J1.17
  Bottom 0.203: v12.7,46.58 v14.93,44.35
P011  (via drill 0.51)
  Top 0.203: v16.76,38.66 16.36,39.07 15.14,39.07 14.53,38.46 14.53,37.85 U$1.P25 | v11.68,45.77 11.68,46.99 10.87,47.8 10.87,49.02 12.7,50.85 J1.19
  Bottom 0.203: v16.76,38.66 16.36,38.66 15.95,39.07 12.29,39.07 11.68,39.68 v11.68,45.77
P012  (via drill 0.51)
  Top 0.203: v13.72,35.81 13.72,37.64 U$1.P26 | v15.34,25.65 15.34,26.67 v16.36,27.69 | v29.97,39.07 29.97,42.52 35.46,48.01 J1.2
  Bottom 0.203: v13.72,35.81 13.72,35 13.11,34.39 13.11,31.75 11.89,30.53 11.89,27.28 13.51,25.65 v15.34,25.65 | v16.36,27.69 18.59,27.69 v29.97,39.07
P013  (via drill 0.51)
  Top 0.203: v22.66,45.16 14.53,45.16 14.12,44.76 14.12,43.94 14.53,43.54 14.53,40.49 13.11,39.07 13.11,37.85 U$1.P27 | v28.35,43.54 33.02,48.21 J1.4
  Bottom 0.203: v22.66,45.16 24.28,43.54 v28.35,43.54
P014  (via drill 0.51)
  Top 0.203: v12.5,35.61 12.5,37.64 U$1.P28 | v14.53,22.2 23.67,22.2 26.11,24.64 26.11,40.69 v25.7,41.1 | v27.33,42.72 27.33,44.96 30.38,48.01 J1.6
  Bottom 0.203: v12.5,35.61 12.5,34.8 12.7,34.6 12.7,33.78 12.29,33.38 11.89,33.38 9.86,31.34 9.86,26.87 v14.53,22.2 | v27.33,42.72 v25.7,41.1
P015  (via drill 0.51)
  Top 0.203: v12.7,39.88 11.68,38.86 11.68,37.85 U$1.P29 | v17.98,39.88 20.22,39.88 v24.69,44.35 | v26.31,45.16 26.31,46.58 27.94,48.21 J1.8
  Bottom 0.203: v17.98,39.88 v12.7,39.88 | v24.69,44.35 25.5,44.35 v26.31,45.16
P016
  Top 0.203: U$1.P30 11.07,37.64 11.07,32.56 12.9,30.73 13.51,30.73 14.53,29.72 14.53,23.42 13.72,22.61 13.72,21.79 14.12,21.39 23.47,21.39 26.52,24.43 26.52,43.74 25.5,44.76 25.5,48.01 J1.10
P017  (via drill 0.51)
  Top 0.203: D3.A 78.74,21.59 79.76,20.57 v79.76,19.15 | J1.12 22.86,48.21 24.69,46.38 v24.69,45.57 20.02,40.89 v17.17,40.89 | v13.72,40.89 12.5,40.89 10.26,38.66 10.26,37.85 U$1.P31
  Bottom 0.203: v79.76,19.15 76.91,19.15 76.3,19.76 71.22,19.76 52.73,38.25 52.73,39.68 46.43,45.97 25.09,45.97 v24.69,45.57 | v17.17,40.89 v13.72,40.89
P018  (via drill 0.51)
  Top 0.203: v13.11,29.92 9.65,33.38 9.65,37.64 U$1.P32 | v18.8,45.97 18.8,46.58 20.22,48.01 J1.14 | v53.34,45.57 54.56,46.79 54.56,47.4 J2.6
  Bottom 0.203: v13.11,29.92 15.55,29.92 17.37,28.09 18.19,28.09 18.8,28.7 v18.8,45.97 | v53.34,45.57 52.12,46.79 21.64,46.79 20.42,48.01 J1.14
P019  (via drill 0.51)
  Top 0.203: v78.94,20.17 78.74,20.17 77.72,19.15 D4.A | U$1.P33 8.84,37.85 8.84,38.46 10.67,40.28 11.28,40.28 13.72,42.72 13.72,44.96 15.55,46.79 16.36,46.79 17.78,48.21 J1.16
  Bottom 0.203: v78.94,20.17 71.43,20.17 53.14,38.46 53.14,39.88 46.63,46.38 19.61,46.38 17.78,48.21 J1.16
P025
  Top 0.203: U$1.P2 7.42,28.3 7.42,11.84 12.7,6.55 J3.19
P026
  Top 0.203: U$1.P3 8.23,28.3 8.23,13.26 15.14,6.35 J3.17
P027
  Top 0.203: U$1.P4 8.84,28.3 8.84,15.49 17.78,6.55 J3.15
P028
  Top 0.203: U$1.P5 9.65,28.3 9.65,16.92 20.22,6.35 J3.13
P029
  Top 0.203: U$1.P6 10.26,28.3 10.26,19.15 22.86,6.55 J3.11
P030
  Top 0.203: U$1.P7 11.07,28.3 11.07,20.57 25.3,6.35 J3.9
P031
  Top 0.203: U$1.P8 11.68,28.3 11.68,22.81 27.94,6.55 J3.7
RX  (via drill 0.51)
  Top 0.203: v23.67,35.2 15.95,35.2 U$1.P21 | v51.92,39.27 51.92,37.85 R6.2 | 40.95,48.01 38.51,50.44 38.51,52.68 37.9,53.29 23.27,53.29 20.83,50.85 20.42,50.85 J1.13 | v40.95,43.54 40.95,48.01 | v70.61,42.32 72.44,44.15 72.44,49.84 72.03,50.24 71.02,50.24 70.61,49.84 70.61,44.15 70.21,43.74 68.99,43.74 67.77,44.96 67.77,46.99 X1.2 | 40.95,48.01 v43.38,50.44
  Bottom 0.203: v23.67,35.2 30.38,41.91 40.95,41.91 | 40.95,41.91 49.28,41.91 v51.92,39.27 | 40.95,41.91 v40.95,43.54 | v70.61,42.32 58.42,42.32 50.29,50.44 v43.38,50.44
SWDCLK
  Top 0.203: 58.01,51.05 58.01,50.24 57,49.23 56.59,49.23 55.98,48.62 55.98,47.6 J2.4 | 58.01,51.05 58.01,52.68 56.59,54.1 10.87,54.1 9.65,52.88 9.65,49.43 3.56,43.33 3.56,40.89 4.17,40.28 5.79,40.28 6.81,39.27 6.81,37.85 U$1.P36 | 58.01,51.05 67.36,51.05 69.39,49.02 69.39,46.99 X1.3
SWDIO  (via drill 0.51)
  Top 0.203: 58.42,47.4 61.47,47.4 65.53,43.33 70.41,43.33 71.43,44.35 71.43,46.99 X1.4 | 58.42,47.4 57.2,47.4 J2.2 | v5.59,39.27 5.99,38.86 5.99,37.85 U$1.P37 | v58.42,47.6 58.42,47.4
  Bottom 0.203: J3.5 30.38,6.35 28.96,7.77 27.74,7.77 5.59,29.92 v5.59,39.27 5.59,41.71 10.46,46.58 10.46,50.65 13.92,54.1 51.31,54.1 57.81,47.6 v58.42,47.6
TX  (via drill 0.51)
  Top 0.203: v61.67,43.13 53.95,43.13 50.49,39.68 50.49,34.8 50.9,34.39 54.36,34.39 55.17,35.2 57,35.2 57.4,34.8 57.4,34.19 U1.4 | v64.31,45.77 65.53,46.99 X1.1 | v12.29,32.56 13.72,32.56 14.73,33.58 15.75,33.58 U$1.P19
  Bottom 0.203: v12.29,32.56 12.29,31.55 11.48,30.73 11.48,27.08 30.38,8.18 44.6,8.18 50.49,2.29 74.07,2.29 77.93,6.15 77.93,13.66 80.98,16.71 80.98,32.36 76.91,36.42 76.91,41.3 72.44,45.77 v64.31,45.77 v61.67,43.13 51.1,53.7 28.75,53.7 25.91,50.85 25.5,50.85 J1.9
VIN  (via drill 0.51)
  Top 0.203: 73.66,6.35 71.22,6.35 J7.18 71.02,6.35 68.58,6.35 | J7.12 63.5,6.35 65.94,6.35 J7.14 66.14,6.35 68.58,6.35 | 68.58,6.35 J7.16 | 66.14,29.92 66.14,28.09 66.95,27.28 IC4.1 | 66.14,29.92 66.14,31.75 66.34,31.95 66.55,31.95 67.16,32.56 C5.1 67.36,32.77 v68.58,33.99 | 73.25,29.92 77.11,33.78 78.74,33.78 J5.VBUS | 66.14,29.92 73.25,29.92 | 73.66,6.35 73.66,11.02 76.1,13.46 76.1,27.08 73.25,29.92 | 73.66,6.35 J7.20
  Bottom 0.203: v68.58,33.99 72.03,37.44 72.03,40.08 BT1.1

### Text on the board
Top: RP-001
tPlace: PWR | TXD | RXD | AUX1 | AUX2
bPlace: Rocket Panda Mk. 1 | DESIGNED AND MANUFACTURED BY ERIC MIN
tStop: RP-001